# Altium schematic sheet Power.SchDoc
size A; SheetNumber: 2; SheetTotal: 6
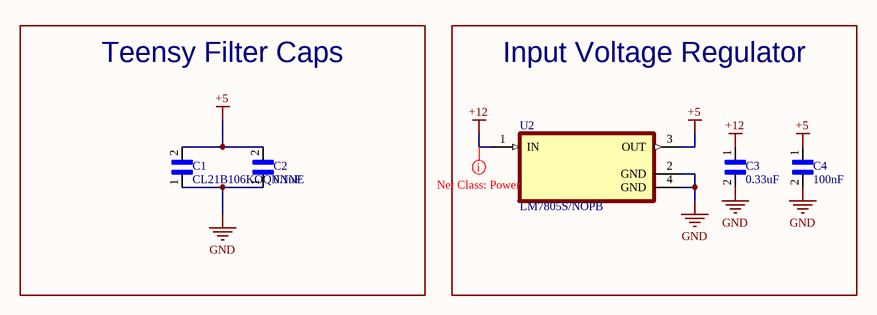
[diagram p0: Power.SchDoc]

## Parts
C1  CL21B106KOQNNNE  [CAPC2012X140N]
C2  0.1uF  [CAPC2012X140N]
C3  0.33uF  [CAPC2012X100N]
C4  100nF  [CAPC2012X140N]
U2  LM7805S/NOPB  [TO254P1524X483-4N]

## Blocks framed on the sheet
Teensy Filter Caps: C1 C2
Input Voltage Regulator: C3 C4 U2

## Nets
+5: C1.2 C2.2 C4.1 U2.3(OUT)
+12: C3.1 U2.1(IN)
GND: C1.1 C2.1 C3.2 C4.2 U2.2(GND) U2.4(GND)

## Layout directives
net class Power: +12

## Library data of the parts
C1 = CL21B106KOQNNNE: Cap Ceramic 10uF 16V X7R 10% Pad SMD 0805 125C T/R; MF: {'manufacturer': u'Samsung'}; Package: None; Availability: Unavailable; Value: *; MP: CL21B106KOQNNNE; Price: None
C2 C4 = 08055G104ZAT1A: CAPACITOR, 0805, 100NF, 50V; Capacitor Application:General Purpose; Dielectric Characteristic:Y5V; Capacitance:0.1ÂµF; Capacitance Tolerance:-20% to +80%; Voltage Rating:50V; Capacitor Case Style:0805; Capacitor Mounting:SMD; Operating Temperature Range:-25Â°C to +85Â°C; SVHC:No SVHC (15-Dec-2010); External Depth:0.95mm; External Length / Height:2mm; External Width:1.25mm; Insulation Resistance:10000Mohm; No. of Pins:2; Operating Temperature Max:85Â°C; Operating Temperature Min:-25Â°C; Package / Case:0805; Reel Quantity:3000; Tape Width:8mm; Temperature Coefficient:+22%, -82%; Terminal Type:Surface Mount (SMD, SMT); Termination Type:SMD; Tolerance +:80%; Tolerance -:20%; Voltage Rating VDC:50V; MF: {'manufacturer': u'AVX'}; Package: None; Availability: Unavailable; Value: *; MP: 08055G104ZAT1A; Price: None
C3 = C0805C334J5RECAUTO: MF: {'manufacturer': u'KEMET'}; Value: *; Package: None; MP: C0805C334J5RECAUTO; Availability: Unavailable; Price: None
U2 = LM7805S/NOPB: MF: {'manufacturer': u'Texas Instruments'}; Price: None; Package: None; Availability: Unavailable; MP: LM7805S/NOPB; Value: *